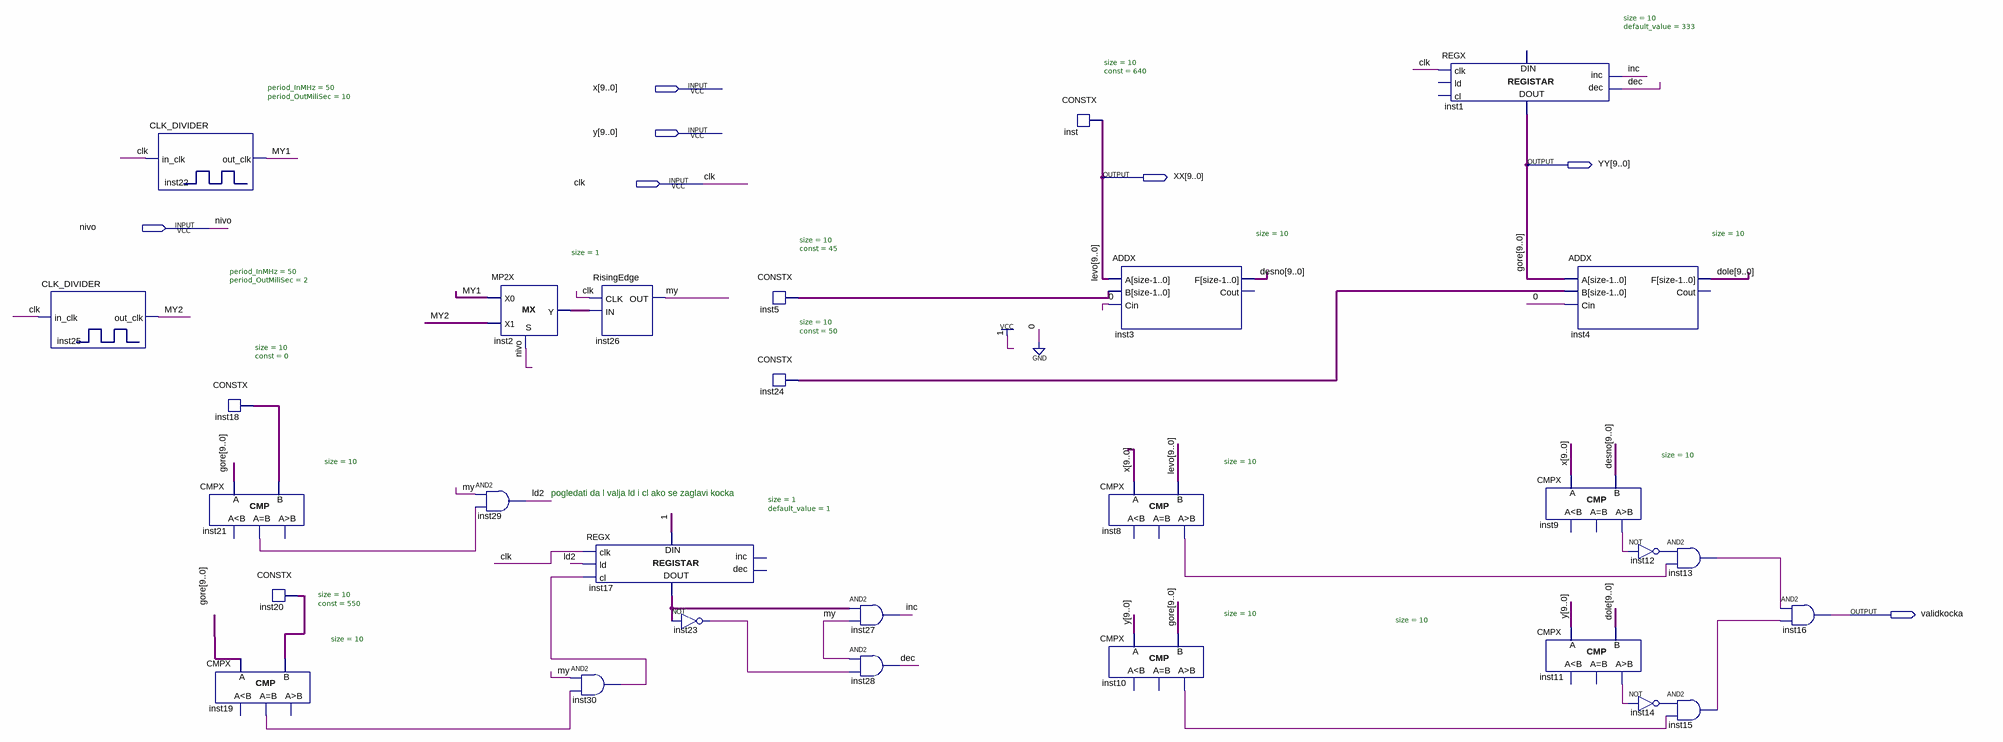
[diagram p0: schematic sheet]
// Quartus schematic kocka10.bdf as structural Verilog: 29 symbols, 7 pins
module kocka10 (
  input  [9:0] x,
  input  [9:0] y,
  input  clk,
  input  nivo,
  output [9:0] YY,
  output [9:0] XX,
  output validkocka
);

  wire dec, inc, inst2_y, inst8_gr, inst9_gr, inst10_gr, inst11_gr, inst12_out, inst13_out, inst14_out,
       inst15_out, inst17_data_out, inst19_eq, inst21_eq, inst23_out, inst30_out, ld2, my, MY1, MY2;
  wire [9:0] desno, dole, inst5_data, inst18_data, inst20_data, inst24_data;

  CLK_DIVIDER #(.period_InMHz(50), .period_OutMiliSec(2)) inst25 (.in_clk(clk), .out_clk(MY2));
  CLK_DIVIDER #(.period_InMHz(50), .period_OutMiliSec(10)) inst22 (.in_clk(clk), .out_clk(MY1));
  CMPX #(.size(10)) inst21 (.A(YY), .B(inst18_data), .eq(inst21_eq));  // open: ls, gr
  CMPX #(.size(10)) inst19 (.A(YY), .B(inst20_data), .eq(inst19_eq));  // open: ls, gr
  CONSTX #(.size(10), .\const (0)) inst18 (.data(inst18_data));
  CONSTX #(.size(10), .\const (550)) inst20 (.data(inst20_data));
  MP2X #(.size(1)) inst2 (.S(nivo), .X0(MY1), .X1(MY2), .Y(inst2_y));
  and inst29 (ld2, my, inst21_eq);
  RisingEdge inst26 (.CLK(clk), .IN(inst2_y), .OUT(my));
  REGX #(.size(1), .default_value(1)) inst17 (
    .clk(clk), .ld(ld2), .cl(inst30_out), .data_in(1'b1), .data_out(inst17_data_out));  // open: inc, dec
  and inst30 (inst30_out, my, inst19_eq);
  not inst23 (inst23_out, inst17_data_out);
  CONSTX #(.size(10), .\const (45)) inst5 (.data(inst5_data));
  CONSTX #(.size(10), .\const (50)) inst24 (.data(inst24_data));
  and inst27 (inc, inst17_data_out, my);
  and inst28 (dec, my, inst23_out);
  CONSTX #(.size(10), .\const (640)) inst (.data(XX));
  ADDX #(.size(10)) inst3 (.A(XX), .B(inst5_data), .Cin(1'b0), .F(desno));  // open: Cout
  CMPX #(.size(10)) inst8 (.A(x), .B(XX), .gr(inst8_gr));  // open: ls, eq
  CMPX #(.size(10)) inst10 (.A(y), .B(YY), .gr(inst10_gr));  // open: ls, eq
  REGX #(.size(10), .default_value(333)) inst1 (
    .clk(clk), .inc(inc), .dec(dec), .data_out(YY));  // open: ld, cl, data_in
  ADDX #(.size(10)) inst4 (.A(YY), .B(inst24_data), .Cin(1'b0), .F(dole));  // open: Cout
  CMPX #(.size(10)) inst9 (.A(x), .B(desno), .gr(inst9_gr));  // open: ls, eq
  CMPX #(.size(10)) inst11 (.A(y), .B(dole), .gr(inst11_gr));  // open: ls, eq
  not inst12 (inst12_out, inst9_gr);
  and inst13 (inst13_out, inst12_out, inst8_gr);
  not inst14 (inst14_out, inst11_gr);
  and inst15 (inst15_out, inst14_out, inst10_gr);
  and inst16 (validkocka, inst13_out, inst15_out);

  // Other names for the same wires on the sheet: levo[9:0] = XX; gore[9:0] = YY

  // Notes on the sheet:
  //   pogledati da l valja ld i cl ako se zaglavi kocka
endmodule
